# Altium schematic sheet nRF24L01.SchDoc
size A4
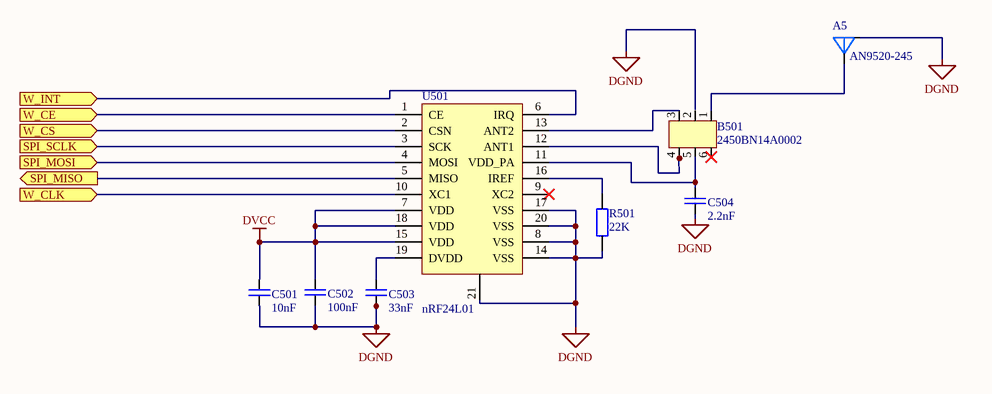
[diagram p0: nRF24L01.SchDoc]

## Parts
A5  AN9520-245  [AN9520-245]
B501  2450BN14A0002  [2450BM14A0002]
C501  10nF  [0603]
C502  100nF  [0603]
C503  33nF  [0603]
C504  2.2nF  [0603]
R501  22K  [0603]
U501  nRF24L01  [nRF24L01]

## Ports
SPI_MISO (out), SPI_MOSI (in), SPI_SCLK (in), W_CE (in), W_CLK (in), W_CS (in), W_INT (in)

## Nets
DGND: A5.2 C501.1 C502.2 C503.1 C504.1 R501.2 U501.8(VSS) U501.14(VSS) U501.17(VSS) U501.20(VSS) U501.21
DVCC: C501.2 C502.1 U501.7(VDD) U501.15(VDD) U501.18(VDD)
SPI_MISO: U501.5(MISO) ; port SPI_MISO
SPI_MOSI: U501.4(MOSI) ; port SPI_MOSI
SPI_SCLK: U501.3(SCK) ; port SPI_SCLK
W_CE: U501.1(CE) ; port W_CE
W_CLK: U501.10(XC1) ; port W_CLK
W_CS: U501.2(CSN) ; port W_CS
W_INT: U501.6(IRQ) ; port W_INT
NetA5_1: A5.1 B501.1
NetB501_3: B501.3 U501.13(ANT2)
NetB501_4: B501.4 U501.12(ANT1)
NetB501_5: B501.5 C504.2 U501.11(VDD_PA)
NetC503_2: C503.2 U501.19(DVDD)
NetR501_1: R501.1 U501.16(IREF)

Not connected (* = marked no-connect by the designer): B501 2 6; U501 9(XC2)*

## Library data of the parts
A5 = AN9520-245: antenna
B501 = 2450BN14A0002: nRF24L01
C501-C504 = C0603
R501 = R0603